# EAGLE board OpticalBoardRev2 (EAGLE 8.2.1), part 1 of 2
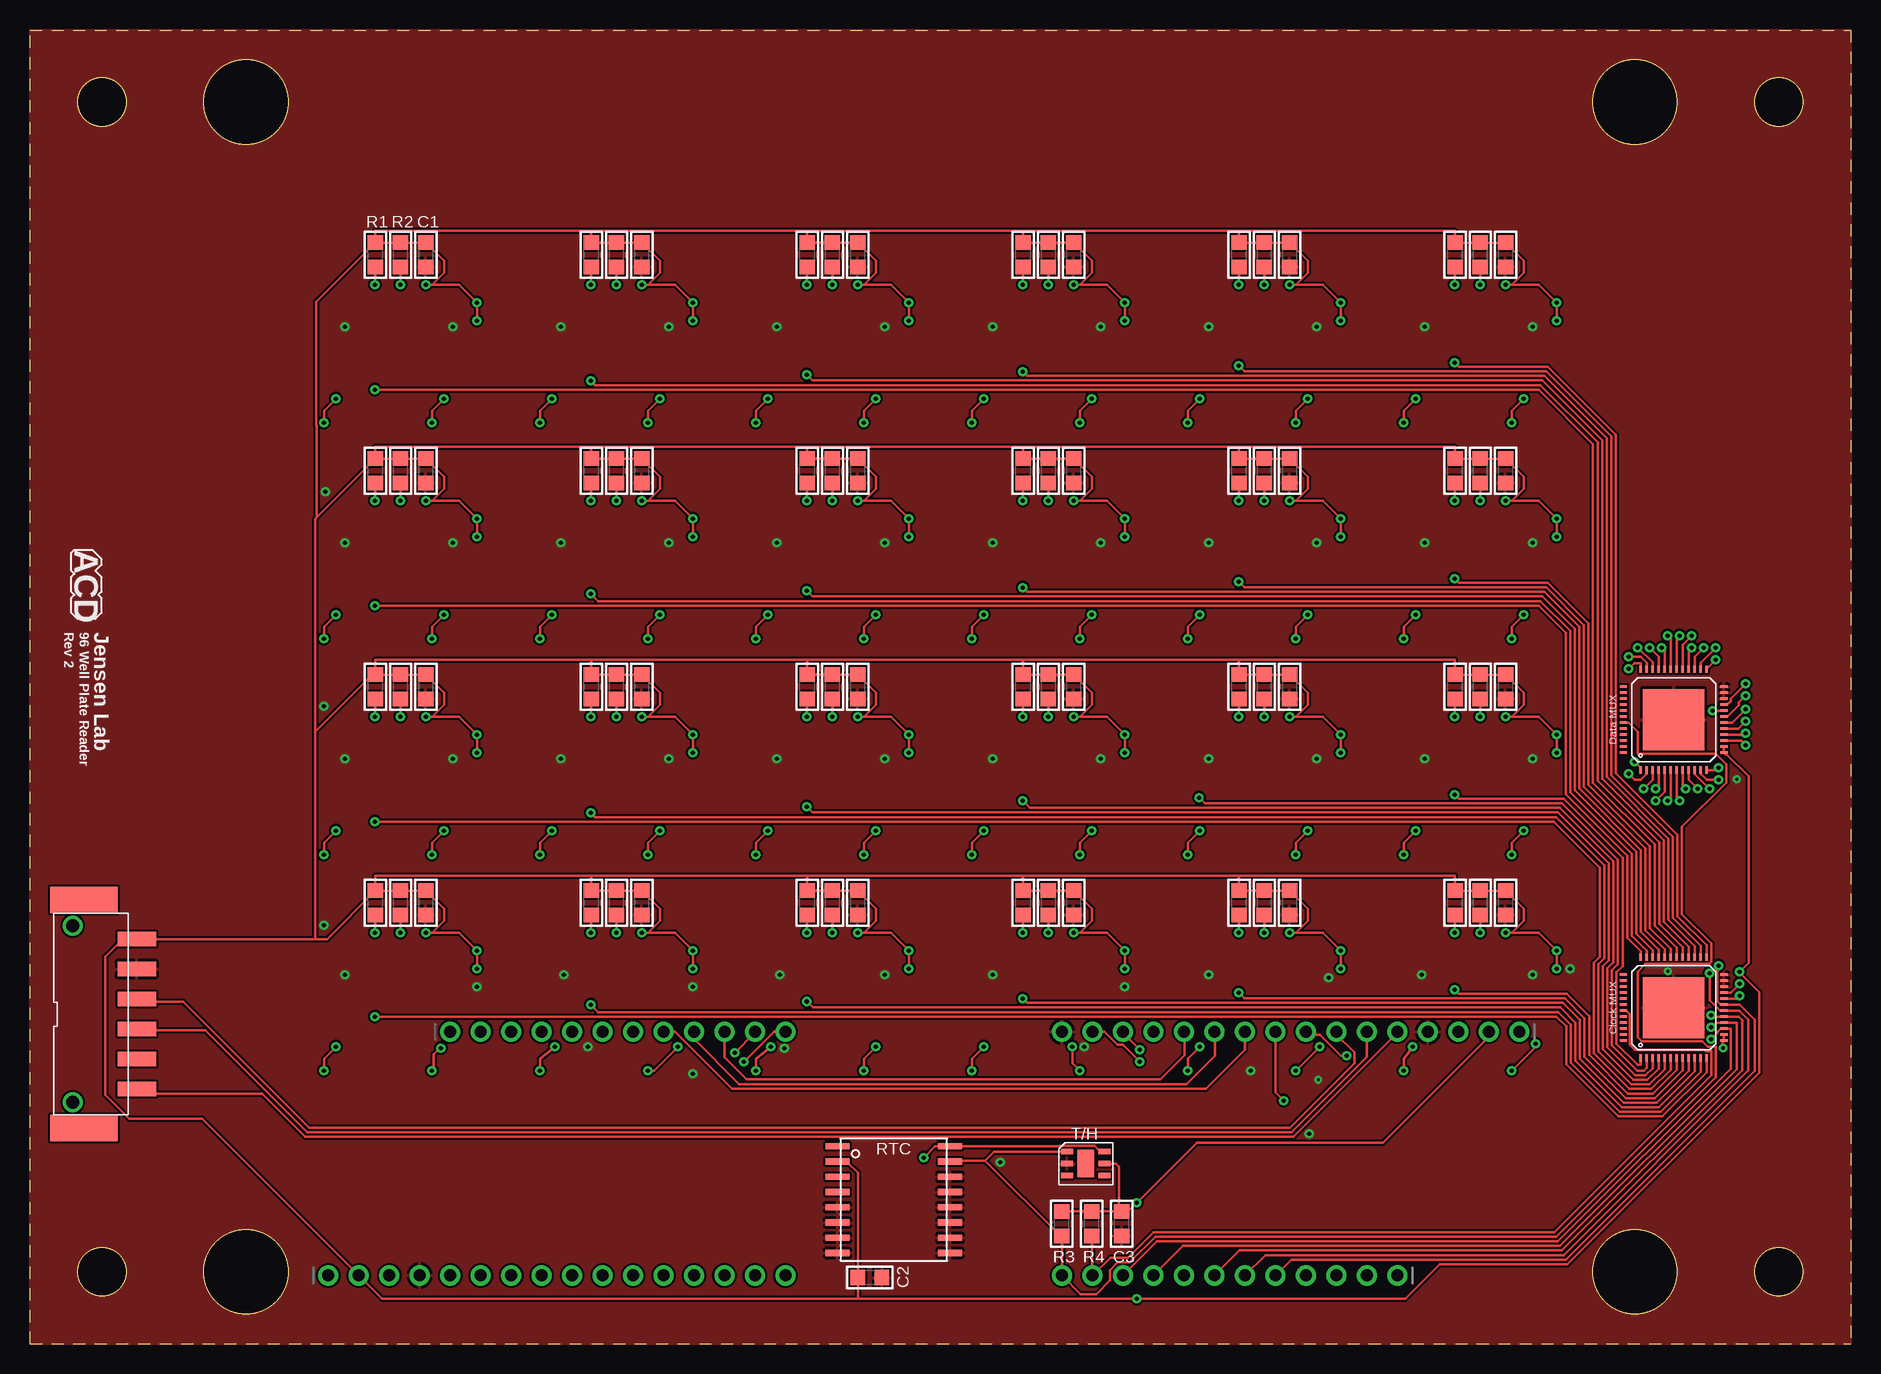
[diagram p2: board, top side]
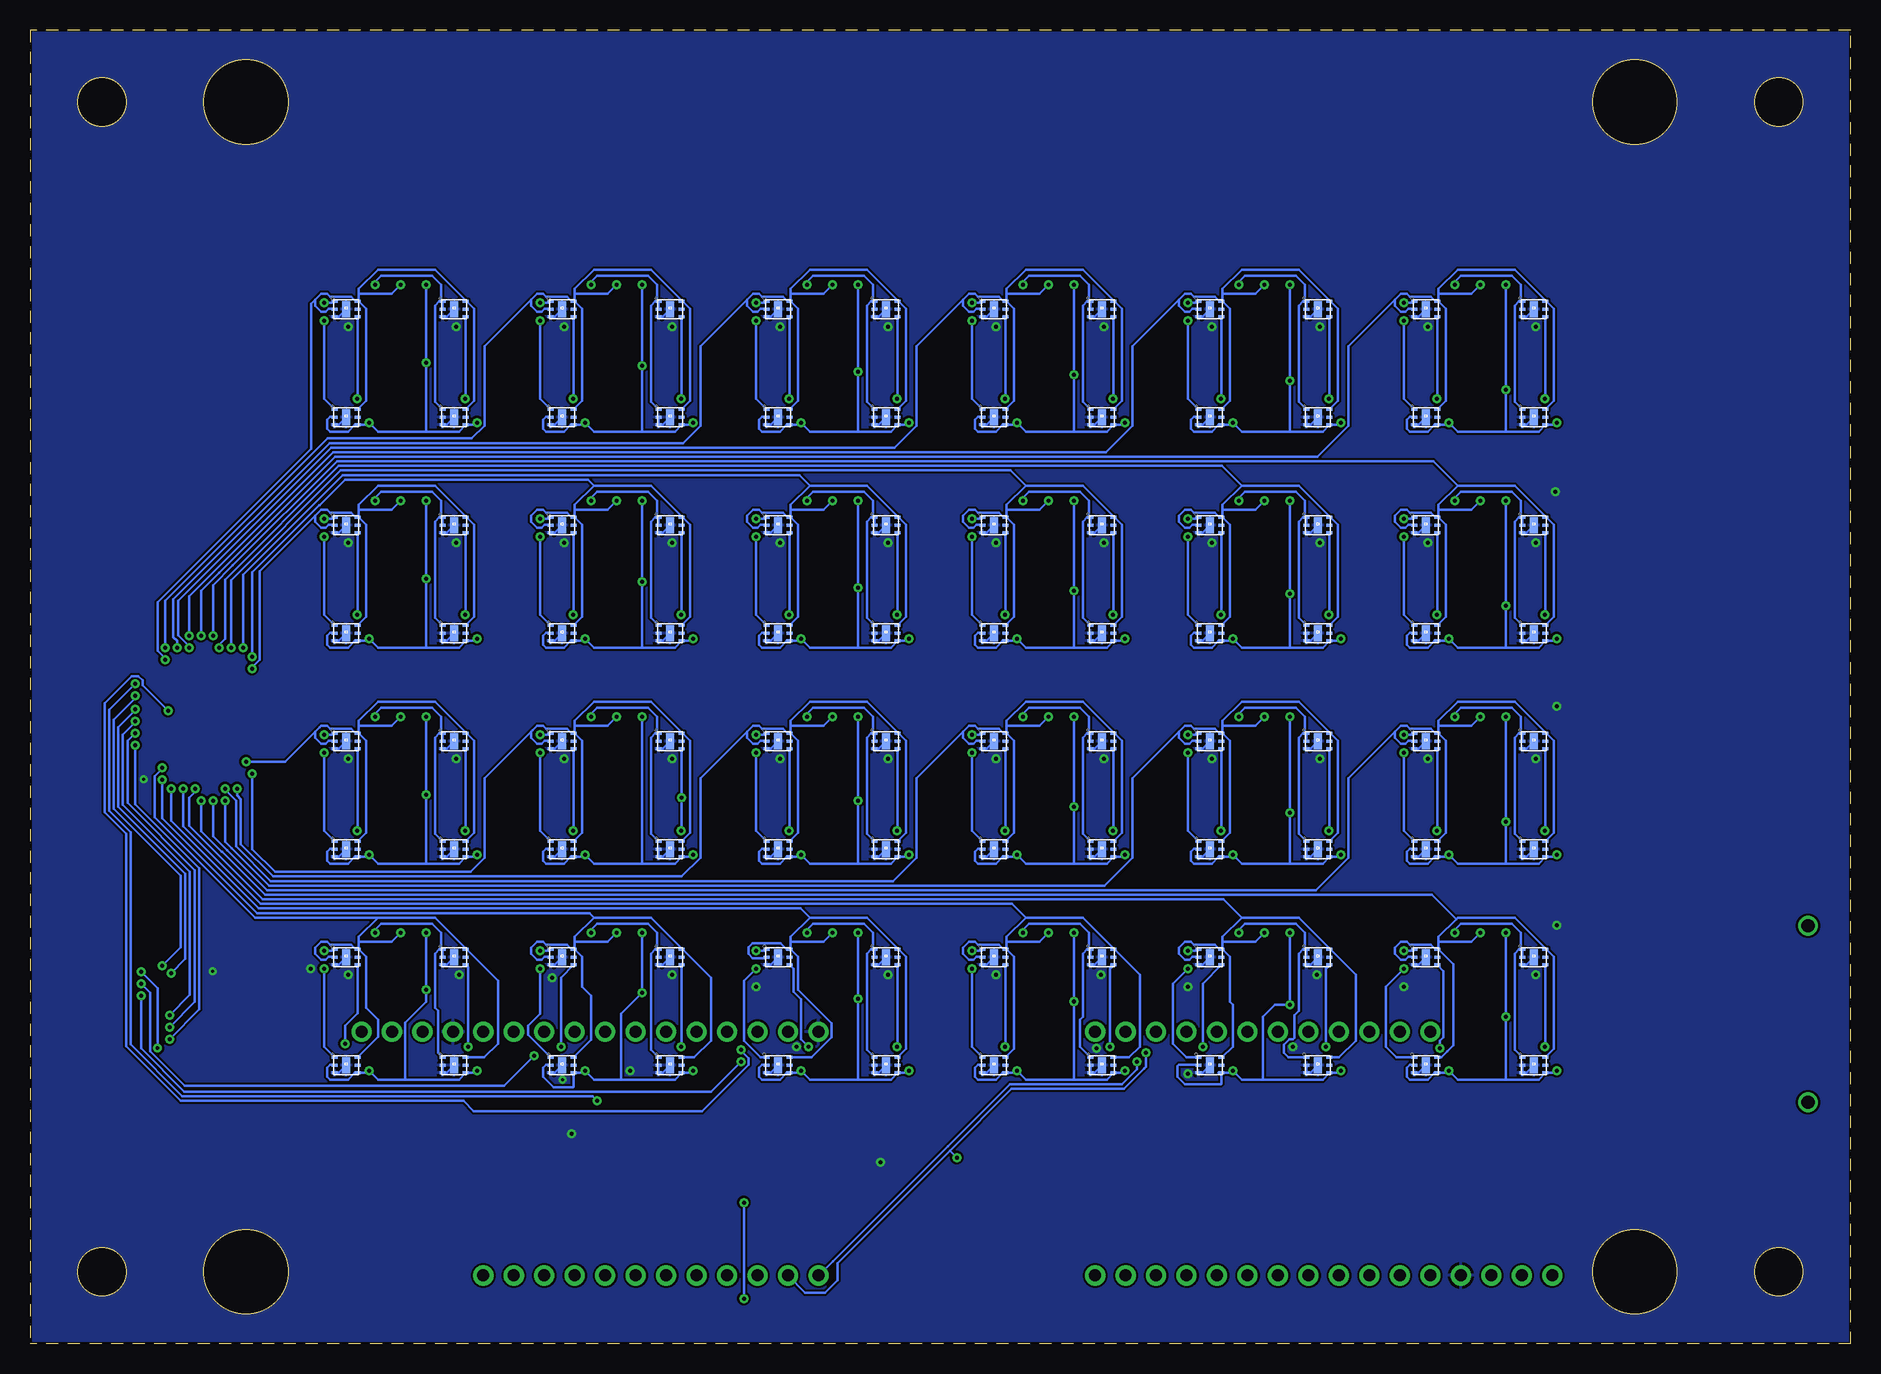
[diagram p3: board, bottom side, seen from below]

Size 151.76 x 109.47 mm. Coordinates in mm from the lower left corner, seen from the top.
Outline: 0,109.47 151.76,109.47 151.76,0 0,0 0,109.47
Outline: circle at 6,6 radius 2
Outline: circle at 145.76,6 radius 2
Outline: circle at 145.76,103.47 radius 2
Outline: circle at 6,103.47 radius 2
Outline: circle at 18,6 radius 3.5
Outline: circle at 18,103.47 radius 3.5
Outline: circle at 133.76,6 radius 3.5
Outline: circle at 133.76,103.47 radius 3.5
Copper layers (1*16): Top 0.035mm / dielectric 1.5mm / Bottom 0.035mm
Design rules "default *": minimum track width 6mil, minimum drill 0.2mm, track to track 7mil, track to pad 6mil, pad to pad 6mil, via to via 6mil, smd to smd 6mil, copper to edge 0mil, drill to drill 6mil, minimum pad ring 10mil, minimum via ring 8mil, stop-mask expansion 4mil, vias tented up to drill 0mil, thermal gap 10mil
Holes 4 mm at 6,6 145.76,6 6,103.47 145.76,103.47
Holes 7 mm at 18,103.47 133.76,103.47 18,6 133.76,6

## Footprints (pad centres in the part's own frame; a part is rotated, then mirrored left to right if it is on the bottom)
_0805 = smd 1.2 x 1.3: 1 -1.016,0; 2 1.016,0
1X12_ROUND = drill 1 pad 1.676: 1 -13.97,0; 2 -11.43,0; 3 -8.89,0; 4 -6.35,0; 5 -3.81,0; 6 -1.27,0; 7 1.27,0; 8 3.81,0; 9 6.35,0; 10 8.89,0; 11 11.43,0; 12 13.97,0
1X16_ROUND = drill 1 pad 1.676: 1 -19.05,0; 2 -16.51,0; 3 -13.97,0; 4 -11.43,0; 5 -8.89,0; 6 -6.35,0; 7 -3.81,0; 8 -1.27,0; 9 1.27,0; 10 3.81,0; 11 6.35,0; 12 8.89,0; 13 11.43,0; 14 13.97,0; 15 16.51,0; 16 19.05,0
2X2-OPT3002-2 = smd 0.5 x 0.25 bottom: 1 -0.95,0.56; 2 -0.95,-0.09; 3 -0.95,-0.74; 4 0.95,-0.74; 5 0.95,-0.09; 6 0.95,0.56; 8 -0.95,9.56; 9 -0.95,8.91; 10 -0.95,8.26; 11 0.95,8.26; 12 0.95,8.91; 13 0.95,9.56; 15 8.05,9.56; 16 8.05,8.91; 17 8.05,8.26; 18 9.95,8.26; 19 9.95,8.91; 20 9.95,9.56; 22 8.05,0.56; 23 8.05,-0.09; 24 8.05,-0.74; 25 9.95,-0.74; 26 9.95,-0.09; 27 9.95,0.56 | smd 0.65 x 1.35 bottom: 7 0,-0.09; 14 0,8.91; 21 9,8.91; 28 9,-0.09 | smd 1.3 x 1.2: 29 6.59,14.456; 30 6.59,12.424; 31 2.39,12.424; 32 2.39,14.456; 33 4.49,12.424; 34 4.49,14.456
CONNECTOR_6PIN = smd 1.2 x 3.2: 1 -6.25,4.4; 2 -3.75,4.4; 3 -1.25,4.4; 4 1.25,4.4; 5 3.75,4.4; 6 6.25,4.4 | drill 1.1: 7 -7.35,-0.95; 8 7.35,-0.95 | smd 2.2 x 5.6: LMOUNT -9.5,0; RMOUNT 9.5,0
32MUX = smd 0.6 x 0.22: 1 -4.2,2.75; 2 -4.2,2.25; 3 -4.2,1.75; 4 -4.2,1.25; 5 -4.2,0.75; 6 -4.2,0.25; 7 -4.2,-0.25; 8 -4.2,-0.75; 9 -4.2,-1.25; 10 -4.2,-1.75; 11 -4.2,-2.25; 12 -4.2,-2.75; 25 4.2,-2.75; 26 4.2,-2.25; 27 4.2,-1.75; 28 4.2,-1.25; 29 4.2,-0.75; 30 4.2,-0.25; 31 4.2,0.25; 32 4.2,0.75; 33 4.2,1.25; 34 4.2,1.75; 35 4.2,2.25; 36 4.2,2.75 | smd 0.22 x 0.6: 13 -2.75,-4.2; 14 -2.25,-4.2; 15 -1.75,-4.2; 16 -1.25,-4.2; 17 -0.75,-4.2; 18 -0.25,-4.2; 19 0.25,-4.2; 20 0.75,-4.2; 21 1.25,-4.2; 22 1.75,-4.2; 23 2.25,-4.2; 24 2.75,-4.2; 37 2.75,4.2; 38 2.25,4.2; 39 1.75,4.2; 40 1.25,4.2; 41 0.75,4.2; 42 0.25,4.2; 43 -0.25,4.2; 44 -0.75,4.2; 45 -1.25,4.2; 46 -1.75,4.2; 47 -2.25,4.2; 48 -2.75,4.2 | smd 5.1 x 5.1: 49 0,0
32MUX_BOT = smd 0.6 x 0.22 bottom: 1 4.2,2.75; 2 4.2,2.25; 3 4.2,1.75; 4 4.2,1.25; 5 4.2,0.75; 6 4.2,0.25; 7 4.2,-0.25; 8 4.2,-0.75; 9 4.2,-1.25; 10 4.2,-1.75; 11 4.2,-2.25; 12 4.2,-2.75; 25 -4.2,-2.75; 26 -4.2,-2.25; 27 -4.2,-1.75; 28 -4.2,-1.25; 29 -4.2,-0.75; 30 -4.2,-0.25; 31 -4.2,0.25; 32 -4.2,0.75; 33 -4.2,1.25; 34 -4.2,1.75; 35 -4.2,2.25; 36 -4.2,2.75 | smd 0.22 x 0.6 bottom: 13 2.75,-4.2; 14 2.25,-4.2; 15 1.75,-4.2; 16 1.25,-4.2; 17 0.75,-4.2; 18 0.25,-4.2; 19 -0.25,-4.2; 20 -0.75,-4.2; 21 -1.25,-4.2; 22 -1.75,-4.2; 23 -2.25,-4.2; 24 -2.75,-4.2; 37 -2.75,4.2; 38 -2.25,4.2; 39 -1.75,4.2; 40 -1.25,4.2; 41 -0.75,4.2; 42 -0.25,4.2; 43 0.25,4.2; 44 0.75,4.2; 45 1.25,4.2; 46 1.75,4.2; 47 2.25,4.2; 48 2.75,4.2 | smd 5.1 x 5.1 bottom: 49 0,0
RTC = smd 1.98 x 0.53: 1 -4.685,4.445; 2 -4.685,3.175; 3 -4.685,1.905; 4 -4.685,0.635; 5 -4.685,-0.635; 6 -4.685,-1.905; 7 -4.685,-3.175; 8 -4.685,-4.445; 9 4.685,-4.445; 10 4.685,-3.175; 11 4.685,-1.905; 12 4.685,-0.635; 13 4.685,0.635; 14 4.685,1.905; 15 4.685,3.175; 16 4.685,4.445
TH_NEW = smd 1 x 0.45: DNC1 -1.55,-1; DNC2 1.55,-1; GND -1.55,0; SCL 1.55,1; SDA -1.55,1; VDD 1.55,0 | smd 1.4 x 2.3: PADDLE 0,0

## Placement (x,y rotation side)
C1  1uF  [_0805]  70,5.5 180 top
C2  0.1uF  [_0805]  91,10 90 top
JP1  [1X12_ROUND]  100,5.68 180 top
JP2  [1X16_ROUND]  105.08,26 180 top
JP3  [1X16_ROUND]  43.92,5.68 0 top
JP4  [1X12_ROUND]  49,26 0 top
R1  10K  [_0805]  88.5,10 90 top
R2  10K  [_0805]  86,10 90 top
U$1  2X2-OPT30022  [2X2-OPT3002-2]  26.4,23.3 0 top
U$2  2X2-OPT30022  [2X2-OPT3002-2]  26.4,41.3 0 top
U$3  2X2-OPT30022  [2X2-OPT3002-2]  26.4,59.3 0 top
U$4  2X2-OPT30022  [2X2-OPT3002-2]  26.4,77.3 0 top
U$5  2X2-OPT30022  [2X2-OPT3002-2]  44.4,23.3 0 top
U$6  2X2-OPT30022  [2X2-OPT3002-2]  44.4,41.3 0 top
U$7  2X2-OPT30022  [2X2-OPT3002-2]  44.4,59.3 0 top
U$8  2X2-OPT30022  [2X2-OPT3002-2]  44.4,77.3 0 top
U$9  2X2-OPT30022  [2X2-OPT3002-2]  62.4,23.3 0 top
U$10  2X2-OPT30022  [2X2-OPT3002-2]  62.4,41.3 0 top
U$11  2X2-OPT30022  [2X2-OPT3002-2]  62.4,59.3 0 top
U$12  2X2-OPT30022  [2X2-OPT3002-2]  62.4,77.3 0 top
U$13  2X2-OPT30022  [2X2-OPT3002-2]  80.4,23.3 0 top
U$14  2X2-OPT30022  [2X2-OPT3002-2]  80.4,41.3 0 top
U$15  2X2-OPT30022  [2X2-OPT3002-2]  80.4,59.3 0 top
U$16  2X2-OPT30022  [2X2-OPT3002-2]  80.4,77.3 0 top
U$17  2X2-OPT30022  [2X2-OPT3002-2]  98.4,23.3 0 top
U$18  2X2-OPT30022  [2X2-OPT3002-2]  98.4,41.3 0 top
U$19  2X2-OPT30022  [2X2-OPT3002-2]  98.4,59.3 0 top
U$20  2X2-OPT30022  [2X2-OPT3002-2]  98.4,77.3 0 top
U$21  2X2-OPT30022  [2X2-OPT3002-2]  116.4,23.3 0 top
U$22  2X2-OPT30022  [2X2-OPT3002-2]  116.4,41.3 0 top
U$23  2X2-OPT30022  [2X2-OPT3002-2]  116.4,59.3 0 top
U$24  2X2-OPT30022  [2X2-OPT3002-2]  116.4,77.3 0 top
U$25  CONNECTOR_6PIN  [CONNECTOR_6PIN]  4.5,27.47 270 top
U$26  32MUXTOP  [32MUX]  137,52 90 top
U$27  32MUXBOT  [32MUX_BOT]  137,28 270 bottom
U$28  RTC  [RTC]  72,12 0 top
U$29  TH_NEW  [TH_NEW]  88,15 0 top

## Tracks (layer width: path | path; a pad name or v marks a point on that pad's centre or on a via)
A
  Top 0.203: JP4.8 53.75,26 58.5,21.25 98,21.25 101.25,24.5 101.25,25.98 JP2.10
A0  (via drill 0.35)
  Top 0.203: JP1.10 93.95,8.52 127.37,8.52 141.75,22.91 141.75,25.96 141.75,25.97 141.75,26.25 U$27.15 140.93,26.25 140.65,25.96 140.65,25.9 v140.12,25.38 | U$26.15 142.62,50.25 v143,49.88
  Bottom 0.203: v140.12,25.38 137.64,27.86 137.64,39.61 143,44.96 v143,49.88
A1  (via drill 0.35)
  Top 0.203: JP1.9 96.11,8.14 127.53,8.14 142.25,22.87 142.25,26.75 U$27.16 140.5,26.75 v140.12,26.38 | U$26.16 142.88,50.75 v143,50.88
  Bottom 0.203: v140.12,26.38 138.03,28.48 138.03,39.45 143.63,45.05 143.63,50.14 143.62,50.14 143.62,50.25 v143,50.88
A2  (via drill 0.35)
  Top 0.203: v140.12,27.38 140.25,27.25 U$27.17 142.42,27.25 142.71,26.96 142.71,22.79 127.68,7.76 100.81,7.76 JP1.7 | U$26.17 142.38,51.25 v143,51.88
  Bottom 0.203: v140.12,27.38 138.43,29.07 138.43,39.32 144.01,44.9 144.01,50.76 143,51.77 v143,51.88
A3  (via drill 0.35)
  Top 0.203: v140,30.88 140,28.62 140.88,27.75 U$27.18 142.46,27.75 143.23,26.98 143.23,22.77 127.84,7.38 102.97,7.38 JP1.6 | U$26.18 141.88,51.75 v143,52.88
  Bottom 0.203: 138.81,34.06 138.83,34.08 | 138.81,34.06 138.81,33.75 138.81,32.06 v140,30.88 | v143,52.88 143,52.77 144.39,51.38 144.39,44.74 138.81,39.16 138.81,34.06
A4  (via drill 0.35)
  Top 0.203: v140.75,31.5 140.65,31.4 140.65,28.54 140.93,28.25 U$27.19 142.5,28.25 143.75,27 143.75,22.75 128,7 105.13,7 JP1.5 | U$26.19 141.47,52.25 142.44,53.22 142.44,53.44 v143,54
  Bottom 0.203: v140.75,31.5 139.21,33.04 139.21,34.23 139.19,34.25 139.19,39 144.78,44.58 144.78,51.99 143,53.77 v143,54
B
  Top 0.203: JP4.9 55.35,25.4 59.12,21.63 70.25,21.63 96.38,21.63 98.75,24 98.75,25.98 JP2.11
C
  Top 0.203: JP4.10 57.89,23.86 59.74,22.01 68.75,22.01 94.22,22.01 96.23,24.02 96.23,25.96 JP2.12
CS1  (via drill 0.35)
  Top 0.203: JP2.14 91.11,25.89 v92.5,24.5 | U$26.20 v140.25,52.75
  Bottom 0.203: v140.25,52.75 142.37,54.87 142.37,55.26 142.74,55.63 143.26,55.63 145.54,53.36 145.54,44.58 | 145.54,44.58 | 145.54,44.58 145.54,44.27 143.75,42.48 143.75,24.77 139.21,20.24 115.63,20.24 114.76,19.37 95.74,19.37 91.87,23.24 91.87,23.76 92.5,24.39 v92.5,24.5
CS2  (via drill 0.35)
  Top 0.203: U$27.20 142.25,28.75 v142.5,29 | v92.5,23.5 91.09,24.91 90.66,24.91 89.56,26 JP2.15
  Bottom 0.203: v142.5,29 142.5,24.6 138.9,21 108.75,21 95,21 v92.5,23.5
GND  (via drill 0.25, 0.35)
  Top 0.203: U$1.30 32.99,35.24 | U$2.30 32.99,53.24 | U$3.30 32.99,71.24 | U$4.30 32.99,89.24 | U$8.30 50.99,89.24 | U$7.30 50.99,71.24 | U$5.30 50.99,35.24 | U$9.30 68.99,35.24 | U$10.30 68.99,53.24 | U$11.30 68.99,71.24 | U$12.30 68.99,89.24 | U$16.30 86.99,89.24 | U$15.30 86.99,71.24 | U$14.30 86.99,53.24 | U$13.30 86.99,35.24 | U$17.30 104.99,35.24 | U$18.30 104.99,53.24 | U$19.30 104.99,71.24 | U$20.30 104.99,89.24 | U$24.30 122.99,89.24 | U$23.30 122.99,71.24 | U$22.30 122.99,53.24 | 122.99,35.24 U$21.30 | U$6.30 50.99,53.24
  Bottom 0.203: U$1.21 36.05,31.56 U$1.18 | U$1.25 36.05,22.56 U$1.28 | U$1.7 27.05,22.56 U$1.4 U$1.5 | U$1.14 27.05,31.56 U$1.11 27.38,31.53 | U$2.21 36.05,49.56 U$2.18 | U$2.25 36.05,40.56 U$2.28 | U$2.7 27.05,40.56 U$2.4 U$2.5 | U$2.14 27.05,49.56 U$2.11 27.38,49.53 | U$3.21 36.05,67.56 U$3.18 | U$3.25 36.05,58.56 U$3.28 | U$3.7 27.05,58.56 U$3.4 U$3.5 | U$3.14 27.05,67.56 U$3.11 27.38,67.53 | U$4.21 36.05,85.56 U$4.18 | U$4.25 36.05,76.56 U$4.28 | U$4.7 27.05,76.56 U$4.4 U$4.5 | U$4.14 27.05,85.56 U$4.11 27.38,85.53 | U$8.21 54.05,85.56 U$8.18 | U$8.25 54.05,76.56 U$8.28 | U$8.7 45.05,76.56 U$8.4 U$8.5 | U$8.14 45.05,85.56 U$8.11 45.38,85.53 | U$7.21 54.05,67.56 U$7.18 | U$7.25 54.05,58.56 U$7.28 | U$7.7 45.05,58.56 U$7.4 U$7.5 | U$7.14 45.05,67.56 U$7.11 45.38,67.53 | U$5.21 54.05,31.56 U$5.18 | U$5.25 54.05,22.56 U$5.28 | U$5.7 45.05,22.56 U$5.4 U$5.5 | U$5.14 45.05,31.56 U$5.11 45.38,31.53 | U$9.21 72.05,31.56 U$9.18 | U$9.25 72.05,22.56 U$9.28 | U$9.7 63.05,22.56 U$9.4 U$9.5 | U$9.14 63.05,31.56 U$9.11 63.38,31.53 | U$10.21 72.05,49.56 U$10.18 | U$10.25 72.05,40.56 U$10.28 | U$10.7 63.05,40.56 U$10.4 U$10.5 | U$10.14 63.05,49.56 U$10.11 63.38,49.53 | U$11.21 72.05,67.56 U$11.18 | U$11.25 72.05,58.56 U$11.28 | U$11.7 63.05,58.56 U$11.4 U$11.5 | U$11.14 63.05,67.56 U$11.11 63.38,67.53 | U$12.21 72.05,85.56 U$12.18 | U$12.25 72.05,76.56 U$12.28 | U$12.7 63.05,76.56 U$12.4 U$12.5 | U$12.14 63.05,85.56 U$12.11 63.38,85.53 | U$16.21 90.05,85.56 U$16.18 | U$16.25 90.05,76.56 U$16.28 | U$16.7 81.05,76.56 U$16.4 U$16.5 | U$16.14 81.05,85.56 U$16.11 81.38,85.53 | U$15.21 90.05,67.56 U$15.18 | U$15.25 90.05,58.56 U$15.28 | U$15.7 81.05,58.56 U$15.4 U$15.5
  Bottom 0.203: U$15.14 81.05,67.56 U$15.11 81.38,67.53 | U$14.21 90.05,49.56 U$14.18 | U$14.25 90.05,40.56 U$14.28 | U$14.7 81.05,40.56 U$14.4 U$14.5 | U$14.14 81.05,49.56 U$14.11 81.38,49.53 | U$13.21 90.05,31.56 U$13.18 | U$13.25 90.05,22.56 U$13.28 | U$13.7 81.05,22.56 U$13.4 U$13.5 | U$13.14 81.05,31.56 U$13.11 81.38,31.53 | U$17.21 108.05,31.56 U$17.18 | U$17.25 108.05,22.56 U$17.28 | U$17.7 99.05,22.56 U$17.4 U$17.5 | U$17.14 99.05,31.56 U$17.11 99.38,31.53 | U$18.21 108.05,49.56 U$18.18 | U$18.25 108.05,40.56 U$18.28 | U$18.7 99.05,40.56 U$18.4 U$18.5 | U$18.14 99.05,49.56 U$18.11 99.38,49.53 | U$19.21 108.05,67.56 U$19.18 | U$19.25 108.05,58.56 U$19.28 | U$19.7 99.05,58.56 U$19.4 U$19.5 | U$19.14 99.05,67.56 U$19.11 99.38,67.53 | U$20.21 108.05,85.56 U$20.18 | U$20.25 108.05,76.56 U$20.28 | U$20.7 99.05,76.56 U$20.4 U$20.5 | U$20.14 99.05,85.56 U$20.11 99.38,85.53 | U$24.21 126.05,85.56 U$24.18 | U$24.25 126.05,76.56 U$24.28 | U$24.7 117.05,76.56 U$24.4 U$24.5 | U$24.14 117.05,85.56 U$24.11 117.38,85.53 | U$23.21 126.05,67.56 U$23.18 | U$23.25 126.05,58.56 U$23.28 | U$23.7 117.05,58.56 U$23.4 U$23.5 | U$23.14 117.05,67.56 U$23.11 117.38,67.53 | U$22.21 126.05,49.56 U$22.18 | U$22.25 126.05,40.56 U$22.28 | U$22.7 117.05,40.56 U$22.4 U$22.5 | U$22.14 117.05,49.56 U$22.11 117.38,49.53 | U$21.21 126.05,31.56 U$21.18 | U$21.25 126.05,22.56 U$21.28 | U$21.7 117.05,22.56 U$21.4 U$21.5 | U$21.14 117.05,31.56 U$21.11 117.38,31.53 | U$6.21 54.05,49.56 U$6.18 | U$6.25 54.05,40.56 U$6.28 | U$6.7 45.05,40.56 U$6.4 U$6.5 | U$6.14 45.05,49.56 U$6.11 45.38,49.53
  Bottom 0.254: 35.44,23.17 U$1.28 | 35.44,41.17 U$2.28 | 35.44,59.17 U$3.28 | 35.44,77.17 U$4.28 | 53.44,77.17 U$8.28 | 53.44,59.17 U$7.28 | 53.44,23.17 U$5.28 | 71.44,23.17 U$9.28 | 71.44,41.17 U$10.28 | 71.44,59.17 U$11.28 | 71.44,77.17 U$12.28 | 89.44,77.17 U$16.28 | 89.44,59.17 U$15.28 | 89.44,41.17 U$14.28 | 89.44,23.17 U$13.28 | 107.44,23.17 U$17.28 | 107.44,41.17 U$18.28 | 107.44,59.17 U$19.28 | 107.44,77.17 U$20.28 | 125.44,77.17 U$24.28 | 125.44,59.17 U$23.28 | 125.44,41.17 U$22.28 | 125.44,23.17 U$21.28 | 53.44,41.17 U$6.28
  other vias: 125.25,66.75 116.25,66.75 125.25,84.75 116.25,84.75 125.25,48.75 116.25,48.75 116,30.75 125.25,30.75 108.25,30.5 98.25,30.75 98.25,48.75 107.25,48.75 107.25,66.75 98.25,66.75 98.25,84.75 107.25,84.75 89.25,84.75 80.25,84.75 80.25,66.75 89.25,66.75 89.25,48.75 80.25,48.75 80.25,30.75 91.25,29.75 71.25,30.75 62.5,30.75 62.25,48.75 71.25,48.75 71.25,66.75 62.25,66.75 62.25,84.75 71.25,84.75 53.25,84.75 44.25,84.75 44.25,66.75 53.25,66.75 53.25,48.75 44.25,48.75 44.5,30.75 55.25,29.75 37.25,29.75 26.25,30.75 26.25,48.75 35.25,48.75 35.25,66.75 26.25,66.75 26.25,84.75 35.25,84.75 136.53,31.03 128.38,31.25 106.62,17.5 46.5,24.75 55.25,22.5 62.88,24.62 107.38,22 101.75,22.75 87.88,24.75 142.28,47.03 80.88,15.12 24.5,34.88 24.5,53.12 24.62,71
  pour Top: 0,0 151.76,0 151.76,109.47 0,109.47
  pour Bottom: 0.25,109.25 0.25,0.25 151.5,0.25 151.5,109.25
LEDCLK
  Top 0.203: 8.93,26.25 U$25.4 9.01,26.11 14.61,26.11 23.09,17.62 105.16,17.62 111.43,23.89 JP2.6
LEDDAT
  Top 0.203: 109,26 JP2.7 108.89,25.75 110.38,24.26 110.38,23.38 105,18 23.25,18 12.75,28.5 9.12,28.5 U$25.3
LEDLAT
  Top 0.203: 23.25,17.24 | 23.25,17.24 22.93,17.24 19.34,20.84 9.28,20.84 U$25.6 | 23.25,17.24 105.32,17.24 113.97,25.89 JP2.5
SCL1  (via drill 0.35)
  Top 0.203: v24.5,22.75 24.5,23.75 v25.5,24.75 | U$1.31 28.75,35.68 v28.75,34.25 | v28.75,27.25 127.24,27.25 128.06,26.43 128.06,23.27 132.38,18.94 136.08,18.94 139.75,22.61 U$27.12 | v34.25,24.62 34.12,24.62 33.62,24.12 33.62,22.88 v33.5,22.75
  Bottom 0.203: U$1.26 36.39,23.25 36.75,23.25 37,23 37,22.25 36.75,22 35.25,22 34.69,22.56 U$1.24 33.69,22.56 v33.5,22.75 | U$1.3 24.69,22.56 v24.5,22.75 | v25.5,24.75 25.45,24.8 U$1.10 | U$1.3 | v33.5,22.75 33.25,22.5 | U$1.3 26,22.01 26,22 28.75,22 | v33.5,22.75 32.75,22 28.75,22 | v28.75,34.25 v28.75,27.25 28.75,22 | v34.25,24.62 34.25,25.23 33.94,25.55 33.94,31.05 U$1.17
SCL2  (via drill 0.35)
  Top 0.203: v33.5,40.75 33.5,41.75 v34.5,42.75 | v24.5,40.75 24.5,41.75 v25.5,42.75 | U$2.31 28.75,53.68 v28.75,52.25 | 123.25,43.5 v28.75,43.5 | 123.25,43.5 123.69,43.5 | U$27.6 136.75,22.84 135.13,21.23 133.33,21.23 130.34,24.21 130.34,31.75 130.84,32.26 130.84,39.66 127,43.5 123.25,43.5
  Bottom 0.203: U$2.26 36.39,41.25 36.75,41.25 37,41 37,40.25 36.75,40 35.25,40 34.69,40.56 U$2.24 33.69,40.56 v33.5,40.75 | v34.5,42.75 34.45,42.8 U$2.17 | U$2.3 24.69,40.56 v24.5,40.75 | v25.5,42.75 25.45,42.8 U$2.10 | U$2.3 | v33.5,40.75 33.25,40.5 | U$2.3 26,40.01 26,40 28.75,40 | v33.5,40.75 32.75,40 28.75,40 | v28.75,52.25 v28.75,43.5 28.75,40
SCL3  (via drill 0.35)
  Top 0.203: v33.5,58.75 33.5,59.75 v34.5,60.75 | v24.5,58.75 24.5,59.75 v25.5,60.75 | U$3.31 28.75,71.68 v28.75,70.25 | v28.75,61.5 125.75,61.5 128,59.25 128,45.79 133.13,40.66 133.13,33.83 134.25,32.71 U$27.36
  Bottom 0.203: U$3.26 36.39,59.25 36.75,59.25 37,59 37,58.25 36.75,58 35.25,58 34.69,58.56 U$3.24 33.69,58.56 v33.5,58.75 | v34.5,60.75 34.45,60.8 U$3.17 | U$3.3 24.69,58.56 v24.5,58.75 | v25.5,60.75 25.45,60.8 U$3.10 | U$3.3 | v33.5,58.75 33.25,58.5 | U$3.3 26,58.01 26,58 28.75,58 | v33.5,58.75 32.75,58 28.75,58 | v28.75,70.25 v28.75,61.5 28.75,58
SCL4  (via drill 0.35)
  Top 0.203: v33.5,76.75 33.5,77.75 v34.5,78.75 | v24.5,76.75 24.5,77.75 v25.5,78.75 | U$4.31 28.75,89.68 v28.75,88.25 | v28.75,79.5 125.75,79.5 130.29,74.96 130.29,46.75 135.42,41.62 135.42,34.83 137.25,33 U$27.30
  Bottom 0.203: U$4.26 36.39,77.25 36.75,77.25 37,77 37,76.25 36.75,76 35.25,76 34.69,76.56 U$4.24 33.69,76.56 v33.5,76.75 | v34.5,78.75 34.45,78.8 U$4.17 | U$4.3 24.69,76.56 v24.5,76.75 | v25.5,78.75 25.45,78.8 U$4.10 | U$4.3 | v33.5,76.75 33.25,76.5 | U$4.3 26,76.01 26,76 28.75,76 | v33.5,76.75 32.75,76 28.75,76 | v28.75,88.25 v28.75,79.5 28.75,76
SCL5  (via drill 0.35)
  Top 0.203: v42.5,22.75 42.5,23.75 v43.75,24.75 | U$5.31 46.75,35.68 v46.75,34.25 | v46.75,28.25 47.37,27.63 127.4,27.63 128.44,26.59 128.44,23.43 132.54,19.32 135.92,19.32 139.25,22.65 U$27.11 | v54,24.75 52,22.75 v51.5,22.75
  Bottom 0.203: U$5.26 54.39,23.25 56,23.25 56.12,23.12 56.12,22.25 55.5,21.62 52.5,21.62 52.45,21.68 U$5.24 | 52.69,22.56 U$5.24 | U$5.24 51.69,22.56 v51.5,22.75 | U$5.3 42.69,22.56 v42.5,22.75 | U$5.3 | v51.5,22.75 51.25,22.5 | U$5.3 44,22.01 44,22 49,22 | v51.5,22.75 50.75,22 49,22 | v46.75,34.25 v46.75,28.25 48,28.25 49,27.25 49,22 | U$5.17 54,30.01 v54,24.75 | U$5.10 43.75,31.26 v43.75,24.75
SCL6  (via drill 0.35)
  Top 0.203: v51.5,40.75 51.5,41.75 v52.5,42.75 | v42.5,40.75 42.5,41.75 v43.5,42.75 | U$6.31 46.75,53.68 v46.75,52.25 | v46.75,44.25 47.12,43.88 127.21,43.88 131.23,39.87 131.23,32.1 130.72,31.6 130.72,24.37 133.49,21.61 134.97,21.61 136.25,22.88 U$27.5
  Bottom 0.203: U$6.26 54.39,41.25 54.75,41.25 55,41 55,40.25 54.75,40 53.25,40 52.69,40.56 U$6.24 51.69,40.56 v51.5,40.75 | v52.5,42.75 52.45,42.8 U$6.17 | U$6.3 42.69,40.56 v42.5,40.75 | v43.5,42.75 43.45,42.8 U$6.10 | U$6.3 | v51.5,40.75 51.25,40.5 | U$6.3 44,40.01 44,40 46.75,40 | v51.5,40.75 50.75,40 46.75,40 | v46.75,52.25 v46.75,44.25 46.75,40
SCL7  (via drill 0.35)
  Top 0.203: v43.5,60.75 42.5,59.75 v42.5,58.75 | U$7.31 46.75,71.68 v46.75,70.25 | v52.5,60.75 51.5,59.75 v51.5,58.75 | v46.75,62.5 47.37,61.88 125.91,61.88 128.38,59.41 128.38,45.95 133.51,40.82 133.51,33.99 134.75,32.75 U$27.35
  Bottom 0.203: U$7.26 54.39,59.25 54.75,59.25 55,59 55,58.25 54.75,58 53.25,58 52.69,58.56 U$7.24 51.69,58.56 v51.5,58.75 | U$7.10 43.45,60.8 v43.5,60.75 | U$7.17 52.45,60.8 v52.5,60.75 | v51.5,58.75 51.25,58.5 | v42.5,58.75 42.69,58.56 U$7.3 | U$7.3 | v46.75,70.25 v46.75,62.5 46.75,58 | v51.5,58.75 50.75,58 46.75,58 | U$7.3 44,58.01 44,58 46.75,58
SCL8  (via drill 0.35)
  Top 0.203: v51.5,76.75 51.5,77.75 v52.5,78.75 | v42.5,76.75 42.5,77.75 v43.5,78.75 | U$8.31 46.75,89.68 v46.75,88.25 | v46.75,80.25 47.12,79.88 125.91,79.88 130.67,75.12 130.67,46.91 135.8,41.78 135.8,35 137.75,33.05 U$27.29
  Bottom 0.203: U$8.26 54.39,77.25 54.75,77.25 55,77 55,76.25 54.75,76 53.25,76 52.69,76.56 U$8.24 51.69,76.56 v51.5,76.75 | v52.5,78.75 52.45,78.8 U$8.17 | U$8.3 42.69,76.56 v42.5,76.75 | v43.5,78.75 43.45,78.8 U$8.10 | U$8.3 | v51.5,76.75 51.25,76.5 | U$8.3 44,76.01 44,76 46.75,76 | v51.5,76.75 50.75,76 46.75,76 | v46.75,88.25 v46.75,80.25 46.75,76
SCL9  (via drill 0.35)
  Top 0.203: v69.5,22.75 69.5,23.75 v70.5,24.75 | v60.5,22.75 60.5,23.75 v61.75,24.75 | U$9.31 64.75,35.68 v64.75,34.25 | v64.75,28.51 65.25,28.01 127.56,28.01 128.82,26.75 128.82,23.58 132.7,19.7 135.76,19.7 138.75,22.69 U$27.10
  Bottom 0.203: U$9.26 72.39,23.25 72.75,23.25 73,23 73,22.25 72.75,22 71.25,22 70.69,22.56 U$9.24 69.69,22.56 v69.5,22.75 | v70.5,24.75 70.45,24.8 U$9.17 | U$9.3 60.69,22.56 v60.5,22.75 | U$9.3 | v69.5,22.75 69.25,22.5 | U$9.3 62,22.01 62,22 64.75,22 | v69.5,22.75 68.75,22 64.75,22 | v64.75,34.25 v64.75,28.51 64.75,22 | v61.75,24.75 61.75,31.26 U$9.10
SCL10  (via drill 0.35)
  Top 0.203: v69.5,40.75 69.5,41.75 v70.5,42.75 | v60.5,40.75 60.5,41.75 v61.5,42.75 | U$10.31 64.75,53.68 v64.75,52.25 | v64.75,44.75 65.24,44.26 127.37,44.26 131.61,40.03 131.61,31.94 131.1,31.44 131.1,24.53 133.65,21.99 134.82,21.99 135.75,22.92 U$27.4
  Bottom 0.203: U$10.26 72.39,41.25 72.75,41.25 73,41 73,40.25 72.75,40 71.25,40 70.69,40.56 U$10.24 69.69,40.56 v69.5,40.75 | v70.5,42.75 70.45,42.8 U$10.17 | U$10.3 60.69,40.56 v60.5,40.75 | v61.5,42.75 61.45,42.8 U$10.10 | U$10.3 | v69.5,40.75 69.25,40.5 | U$10.3 62,40.01 62,40 64.75,40 | v69.5,40.75 68.75,40 64.75,40 | v64.75,52.25 v64.75,44.75 64.75,40
SCL11  (via drill 0.35)
  Top 0.203: v69.5,58.75 69.5,59.75 v70.5,60.75 | v60.5,58.75 60.5,59.75 v61.5,60.75 | U$11.31 64.75,71.68 v64.75,70.25 | v64.75,62.75 65.24,62.26 126.07,62.26 128.76,59.57 128.76,46.1 133.89,40.97 133.89,34.15 135.25,32.79 U$27.34
  Bottom 0.203: U$11.26 72.39,59.25 72.75,59.25 73,59 73,58.25 72.75,58 71.25,58 70.69,58.56 U$11.24 69.69,58.56 v69.5,58.75 | v70.5,60.75 70.45,60.8 U$11.17 | U$11.3 60.69,58.56 v60.5,58.75 | v61.5,60.75 61.45,60.8 U$11.10 | U$11.3 | v69.5,58.75 69.25,58.5 | U$11.3 62,58.01 62,58 64.75,58 | v69.5,58.75 68.75,58 64.75,58 | v64.75,70.25 v64.75,62.75 64.75,58
SCL12  (via drill 0.35)
  Top 0.203: v69.5,76.75 69.5,77.75 v70.5,78.75 | v60.5,76.75 60.5,77.75 v61.5,78.75 | U$12.31 64.75,89.68 v64.75,88.25 | v64.75,80.75 65.24,80.26 126.07,80.26 131.05,75.28 131.05,47.07 136.18,41.94 136.18,35.16 138.25,33.09 U$27.28
  Bottom 0.203: U$12.26 72.39,77.25 72.75,77.25 73,77 73,76.25 72.75,76 71.25,76 70.69,76.56 U$12.24 69.69,76.56 v69.5,76.75 | v70.5,78.75 70.45,78.8 U$12.17 | U$12.3 60.69,76.56 v60.5,76.75 | v61.5,78.75 61.45,78.8 U$12.10 | U$12.3 | v69.5,76.75 69.25,76.5 | U$12.3 62,76.01 62,76 64.75,76 | v69.5,76.75 68.75,76 64.75,76 | v64.75,88.25 v64.75,80.75 64.75,76
SCL13  (via drill 0.35)
  Top 0.203: v78.5,22.75 78.5,23.75 v79.5,24.75 | U$13.31 82.75,35.68 v82.75,34.25 | v82.75,28.75 83.11,28.39 127.78,28.39 129.2,26.97 129.2,23.74 132.86,20.08 135.6,20.08 138.25,22.73 U$27.9 | v86.88,24.75 86.88,23.38 v87.5,22.75
  Bottom 0.203: U$13.26 90.39,23.25 90.75,23.25 91,23 91,22.25 90.75,22 89.25,22 88.69,22.56 U$13.24 87.69,22.56 v87.5,22.75 | U$13.3 78.69,22.56 v78.5,22.75 | v79.5,24.75 79.45,24.8 U$13.10 | U$13.3 | v87.5,22.75 87.25,22.5 | U$13.3 80,22.01 80,22 82.75,22 | v87.5,22.75 86.75,22 82.75,22 | v82.75,34.25 v82.75,28.75 82.75,22 | U$13.17 88.13,31.24 88.13,29.34 87.48,28.69 87.48,25.55 87.5,25.52 87.5,25.38 v86.88,24.75
SCL14  (via drill 0.35)
  Top 0.203: v87.5,40.75 87.5,41.75 v88.5,42.75 | v78.5,40.75 78.5,41.75 v79.5,42.75 | U$14.31 82.75,53.68 v82.75,52.25 | v82.75,45.25 83.36,44.64 127.53,44.64 131.99,40.18 131.99,31.79 131.48,31.28 131.48,24.69 133.8,22.37 134.66,22.37 135.25,22.96 U$27.3
  Bottom 0.203: U$14.26 90.39,41.25 90.75,41.25 91,41 91,40.25 90.75,40 89.25,40 88.69,40.56 U$14.24 87.69,40.56 v87.5,40.75 | v88.5,42.75 88.45,42.8 U$14.17 | U$14.3 78.69,40.56 v78.5,40.75 | v79.5,42.75 79.45,42.8 U$14.10 | U$14.3 | v87.5,40.75 87.25,40.5 | U$14.3 80,40.01 80,40 82.75,40 | v87.5,40.75 86.75,40 82.75,40 | v82.75,52.25 v82.75,45.25 82.75,40
SCL15  (via drill 0.35)
  Top 0.203: v87.5,58.75 87.5,59.75 v88.5,60.75 | v78.5,58.75 78.5,59.75 v79.5,60.75 | U$15.31 82.75,71.68 v82.75,70.25 | v82.75,63 83.11,62.64 126.22,62.64 129.14,59.72 129.14,46.26 134.27,41.13 134.27,34.3 135.75,32.83 U$27.33
  Bottom 0.203: U$15.26 90.39,59.25 90.75,59.25 91,59 91,58.25 90.75,58 89.25,58 88.69,58.56 U$15.24 87.69,58.56 v87.5,58.75 | v88.5,60.75 88.45,60.8 U$15.17 | U$15.3 78.69,58.56 v78.5,58.75 | v79.5,60.75 79.45,60.8 U$15.10 | U$15.3 | v87.5,58.75 87.25,58.5 | U$15.3 80,58.01 80,58 82.75,58 | v87.5,58.75 86.75,58 82.75,58 | v82.75,70.25 v82.75,63 82.75,58
SCL16  (via drill 0.35)
  Top 0.203: v87.5,76.75 87.5,77.75 v88.5,78.75 | v78.5,76.75 78.5,77.75 v79.5,78.75 | U$16.31 82.75,89.68 v82.75,88.25 | v82.75,81 83.11,80.64 126.22,80.64 131.43,75.44 131.43,47.22 136.56,42.09 136.56,35.32 138.75,33.13 U$27.27
  Bottom 0.203: U$16.26 90.39,77.25 90.75,77.25 91,77 91,76.25 90.75,76 89.25,76 88.69,76.56 U$16.24 87.69,76.56 v87.5,76.75 | v88.5,78.75 88.45,78.8 U$16.17 | U$16.3 78.69,76.56 v78.5,76.75 | v79.5,78.75 79.45,78.8 U$16.10 | U$16.3 | v87.5,76.75 87.25,76.5 | U$16.3 80,76.01 80,76 82.75,76 | v87.5,76.75 86.75,76 82.75,76 | v82.75,88.25 v82.75,81 82.75,76
SCL17  (via drill 0.35)
  Top 0.203: v105.5,22.75 v107.5,24.75 | v96.5,22.75 96.5,23.75 v97.5,24.75 | U$17.31 100.75,35.68 v100.75,34.25 | v100.75,29.25 101.23,28.77 127.94,28.77 129.58,27.13 129.58,23.9 133.01,20.46 135.45,20.46 137.75,22.77 U$27.8
  Bottom 0.203: U$17.26 108.39,23.25 108.75,23.25 109,23 109,22.25 108.13,21.38 106.49,21.38 106.45,21.43 U$17.24 105.69,22.56 v105.5,22.75 | U$17.3 96.69,22.56 v96.5,22.75 | v97.5,24.75 97.45,24.8 U$17.10 | U$17.3 | v105.5,22.75 105.25,22.5 | U$17.3 98,22.01 98,22 102.5,22 | v105.5,22.75 104.75,22 102.5,22 | v100.75,34.25 v100.75,29.25 102.5,27.5 102.5,22 | U$17.17 107.5,30.51 v107.5,24.75
SCL18  (via drill 0.35)
  Top 0.203: v105.5,40.75 105.5,41.75 v106.5,42.75 | v96.5,40.75 96.5,41.75 v97.5,42.75 | U$18.31 100.75,53.68 v100.75,52.25 | v97.45,45.5 97.93,45.02 123.25,45.02 | 123.25,45.02 123.56,45.02 | U$27.2 134.75,23 134.5,22.75 133.96,22.75 131.87,24.85 131.87,31.12 132.37,31.63 132.37,40.34 127.69,45.02 123.25,45.02
  Bottom 0.203: U$18.26 108.39,41.25 108.75,41.25 109,41 109,40.25 108.75,40 107.25,40 106.69,40.56 U$18.24 105.69,40.56 v105.5,40.75 | v106.5,42.75 106.45,42.8 U$18.17 | U$18.3 96.69,40.56 v96.5,40.75 | v97.5,42.75 97.45,42.8 v97.45,45.5 U$18.10 | U$18.3 | v105.5,40.75 105.25,40.5 | U$18.3 98,40.01 98,40 100.75,40 | v105.5,40.75 104.75,40 100.75,40 | v100.75,52.25 100.75,40
SCL19  (via drill 0.35)
  Top 0.203: v105.5,58.75 105.5,59.75 v106.5,60.75 | v96.5,58.75 96.5,59.75 v97.5,60.75 | U$19.31 100.75,71.68 v100.75,70.25 | v100.75,63.5 101.23,63.02 126.38,63.02 129.52,59.88 129.52,46.42 134.66,41.29 134.66,34.46 136.25,32.87 U$27.32
  Bottom 0.203: U$19.26 108.39,59.25 108.75,59.25 109,59 109,58.25 108.75,58 107.25,58 106.69,58.56 U$19.24 105.69,58.56 v105.5,58.75 | v106.5,60.75 106.45,60.8 U$19.17 | U$19.3 96.69,58.56 v96.5,58.75 | v97.5,60.75 97.45,60.8 U$19.10 | U$19.3 | v105.5,58.75 105.25,58.5 | U$19.3 98,58.01 98,58 100.75,58 | v105.5,58.75 104.75,58 100.75,58 | v100.75,70.25 v100.75,63.5 100.75,58
SCL20  (via drill 0.35)
  Top 0.203: v105.5,76.75 105.5,77.75 v106.5,78.75 | v96.5,76.75 96.5,77.75 v97.5,78.75 | U$20.31 100.75,89.68 v100.75,88.25 | v100.75,81.5 101.23,81.02 125.25,81.02 | 125.25,81.02 125.38,81.02 | 125.25,81.02 126.38,81.02 131.81,75.59 131.81,47.38 136.94,42.25 136.94,35.47 139.25,33.16 U$27.26
  Bottom 0.203: U$20.26 108.39,77.25 108.75,77.25 109,77 109,76.25 108.75,76 107.25,76 106.69,76.56 U$20.24 105.69,76.56 v105.5,76.75 | v106.5,78.75 106.45,78.8 U$20.17 | U$20.3 96.69,76.56 v96.5,76.75 | v97.5,78.75 97.45,78.8 U$20.10 | U$20.3 | v105.5,76.75 105.25,76.5 | U$20.3 98,76.01 98,76 100.75,76 | v105.5,76.75 104.75,76 100.75,76 | v100.75,88.25 v100.75,81.5 100.75,76
SCL21  (via drill 0.35)
  Top 0.203: v114.5,22.75 114.5,23.75 v115.25,24.75 | U$21.31 118.75,35.68 v118.75,34.25 | v118.75,29.5 119.09,29.16 128.09,29.16 129.96,27.29 129.96,24.06 133.17,20.84 135.29,20.84 137.25,22.81 U$27.7 | v125.5,25 125.5,24.75 v123.5,22.75
  Bottom 0.203: U$21.26 126.39,23.25 126.75,23.25 127,23 127,22.25 126.75,22 125.25,22 124.69,22.56 U$21.24 123.69,22.56 v123.5,22.75 | U$21.3 114.69,22.56 v114.5,22.75 | U$21.3 | v123.5,22.75 123.25,22.5 | U$21.3 116,22.01 116,22 120.5,22 | v123.5,22.75 122.75,22 120.5,22 | v118.75,34.25 v118.75,29.5 118.75,28.5 120.5,26.75 120.5,26.45 120.5,25.55 120.5,22 | U$21.10 115.25,31.36 v115.25,24.75 | v125.5,25 125.5,26.5 124.45,27.55 U$21.17
SCL22  (via drill 0.35)
  Top 0.203: v123.5,40.75 123.5,41.75 v124.5,42.75 | v114.5,40.75 114.5,41.75 v115.5,42.75 | U$22.31 118.75,53.68 v118.75,52.25 | v118.75,45.75 119.09,45.41 127.84,45.41 132.75,40.5 132.75,31.47 132.25,30.96 132.25,25 134,23.25 134.25,23.25 U$27.1
  Bottom 0.203: U$22.26 126.39,41.25 126.75,41.25 127,41 127,40.25 126.75,40 125.25,40 124.69,40.56 U$22.24 123.69,40.56 v123.5,40.75 | v124.5,42.75 124.45,42.8 U$22.17 | U$22.3 114.69,40.56 v114.5,40.75 | v115.5,42.75 115.45,42.8 U$22.10 | U$22.3 | v123.5,40.75 123.25,40.5 | U$22.3 116,40.01 116,40 118.75,40 | v123.5,40.75 122.75,40 118.75,40 | v118.75,52.25 v118.75,45.75 118.75,40
SCL23  (via drill 0.35)
  Top 0.203: v123.5,58.75 123.5,59.75 v124.5,60.75 | v114.5,58.75 114.5,59.75 v115.5,60.75 | U$23.31 118.75,71.68 v118.75,70.25 | v118.75,63.75 119.09,63.41 126.54,63.41 129.91,60.04 129.91,46.58 135.04,41.45 135.04,34.62 136.75,32.91 U$27.31
  Bottom 0.203: U$23.26 126.39,59.25 126.75,59.25 127,59 127,58.25 126.75,58 125.25,58 124.69,58.56 U$23.24 123.69,58.56 v123.5,58.75 | v124.5,60.75 124.45,60.8 U$23.17 | U$23.3 114.69,58.56 v114.5,58.75 | v115.5,60.75 115.45,60.8 U$23.10 | U$23.3 | v123.5,58.75 123.25,58.5 | U$23.3 116,58.01 116,58 118.75,58 | v123.5,58.75 122.75,58 118.75,58 | v118.75,70.25 v118.75,63.75 118.75,58
SCL24  (via drill 0.35)
  Top 0.203: v123.5,76.75 123.5,77.75 v124.5,78.75 | v114.5,76.75 114.5,77.75 v115.5,78.75 | U$24.31 118.75,89.68 v118.75,88.25 | v118.75,81.75 119.09,81.41 126.54,81.41 132.19,75.75 132.19,47.54 137.32,42.41 137.32,35.63 139.75,33.2 U$27.25
  Bottom 0.203: U$24.26 126.39,77.25 126.75,77.25 127,77 127,76.25 126.75,76 125.25,76 124.69,76.56 U$24.24 123.69,76.56 v123.5,76.75 | v124.5,78.75 124.45,78.8 U$24.17 | U$24.3 114.69,76.56 v114.5,76.75 | v115.5,78.75 115.45,78.8 U$24.10 | U$24.3 | v123.5,76.75 123.25,76.5 | U$24.3 116,76.01 116,76 118.75,76 | v123.5,76.75 122.75,76 118.75,76 | v118.75,88.25 v118.75,81.75 118.75,76
SCLK  (via drill 0.35)
  Top 0.203: JP4.11 60.43,25.93 v58.75,24.25 | v74.5,15.5 75.44,16.45 U$28.16 85.81,16.45 85.84,16.48 88.73,16.48 89.21,16 U$29.SCL | U$27.43 133.07,27.75 133.35,27.46 133.35,24.9 133.75,24.5 139.57,24.5 139.71,24.36 140.13,24.36 140.13,22.36 127.05,9.29 93.64,9.29 91.51,7.15 90.04,7.15 JP1.11 88.5,5.75 R1.1
  Bottom 0.203: 58.91,22.91 60.58,21.24 69.93,21.24 75.09,16.09 | 58.91,22.91 58.87,22.95 | 75.09,16.09 84.46,6.71 84.46,5.29 85.5,4.25 87.14,4.25 JP1.11 | v74.5,15.5 75.09,16.09 | 58.91,22.91 58.75,23.07 v58.75,24.25
SDA1  (via drill 0.35)
  Top 0.203: 30.88,35.71 U$1.33 31,35.61 30.88,35.49 v30.88,34.25 | U$26.7 137.25,45.5 v137.5,45.25
  Bottom 0.152: U$1.15 34.61,32.86
  Bottom 0.203: U$1.19 36.39,32.25 36.86,32.25 37.11,32 37.5,32 38,32.5 38,33 37.5,33.5 37,33.5 36.75,33.25 35,33.25 34.61,32.86 | 34.36,32.86 U$1.15 | U$1.1 24.75,24.56 24.75,32.25 25.36,32.86 | 25.36,32.86 U$1.8 25.61,32.86 | 34.36,33.5 34.36,33.89 32.88,35.38 | 34.36,33.5 34.36,32.86 | 25.36,32.86 28,35.5 32.75,35.5 32.88,35.38 | v30.88,34.25 31.62,33.5 34.36,33.5 | v137.5,45.25 137.5,42.69 135.78,40.97 135.72,40.97 132.16,37.41 34.91,37.41 32.88,35.38 | 34.14,23.86 U$1.22 34.14,23.86 | 34.36,32.86 33.12,31.62 33.12,24.88 33.62,24.38 33.62,24.36 34.12,23.86 34.14,23.86
SDA2  (via drill 0.35)
  Top 0.203: 30.88,53.71 U$2.33 31,53.61 30.88,53.49 v30.88,52.25 | U$26.6 136.75,45.5 v136.5,45.25
  Bottom 0.152: U$2.15 34.61,50.86
  Bottom 0.203: U$2.19 36.39,50.25 36.86,50.25 37.11,50 37.5,50 38,50.5 38,51 | 38,51 37.5,51.5 37,51.5 36.75,51.25 35,51.25 34.61,50.86 | U$2.22 33.75,42.56 33.75,50.25 34.36,50.86 | 34.36,50.86 U$2.15 | U$2.1 24.75,42.56 24.75,50.25 25.36,50.86 | 25.36,50.86 U$2.8 25.61,50.86 | 34.36,51.5 34.36,51.89 32.75,53.5 28,53.5 25.36,50.86 | 34.36,51.5 34.36,50.86 | v30.88,52.25 31.62,51.5 34.36,51.5 | 135.34,41.13 | 135.34,41.13 132,37.79 44.57,37.79 41.87,40.49 41.87,47.13 38,51 | v136.5,45.25 136.5,42.29 135.34,41.13
SDA3  (via drill 0.35)
  Top 0.203: 30.88,71.71 U$3.33 31,71.61 30.88,71.49 v30.88,70.25 | v136.5,59 136.75,58.75 U$26.31
  Bottom 0.152: U$3.15 34.61,68.86
  Bottom 0.203: U$3.19 36.39,68.25 36.86,68.25 37.11,68 37.5,68 38,68.5 38,69 37.5,69.5 37,69.5 36.75,69.25 35,69.25 34.61,68.86 | U$3.22 33.75,60.56 33.75,68.25 34.36,68.86 | 34.36,68.86 U$3.15 | U$3.1 24.75,60.56 24.75,68.25 25.36,68.86 | 25.36,68.86 U$3.8 25.61,68.86 | 34.36,69.5 34.36,69.89 32.75,71.5 | 34.36,69.5 34.36,68.86 | 32.75,71.5 28,71.5 25.36,68.86 | v30.88,70.25 31.62,69.5 34.36,69.5 | v136.5,59 136.5,61.25 | 136.5,61.25 136.5,61.56 | 136.5,61.25 136.5,63.19 134.85,64.85 126.17,73.52 120,73.52 | 120,73.52 119.75,73.52 119.5,73.52 | 120,73.52 34.77,73.52 32.75,71.5
SDA4  (via drill 0.35)
  Top 0.203: 30.88,89.71 U$4.33 31,89.61 30.88,89.49 v30.88,88.25 | v137.5,59 137.25,58.75 U$26.30
  Bottom 0.152: U$4.15 34.61,86.86
  Bottom 0.203: U$4.19 36.39,86.25 36.86,86.25 37.11,86 37.5,86 38,86.5 38,87 37.5,87.5 | 37.5,87.5 37,87.5 36.75,87.25 35,87.25 34.61,86.86 | U$4.22 33.75,78.56 33.75,86.25 34.36,86.86 | 34.36,86.86 U$4.15 | U$4.1 24.75,78.56 24.75,86.25 25.36,86.86 | 25.36,86.86 U$4.8 25.61,86.86 | 34.36,87.5 34.36,87.89 32.75,89.5 28,89.5 25.36,86.86 | 34.36,87.5 34.36,86.86 | v30.88,88.25 31.62,87.5 34.36,87.5 | v137.5,59 137.5,61.96 137.5,62.25 137.5,62.73 135.99,64.24 126.33,73.91 124.5,73.91 123,73.91 | 123,73.91 121.25,73.91 | 37.5,87.5 41.87,83.13 41.87,76.49 44.45,73.91 123,73.91
SDA5  (via drill 0.35)
  Top 0.203: 48.88,35.71 U$5.33 49,35.61 48.88,35.49 v48.88,34.25 | U$26.8 137.75,46.5 v138,46.25
  Bottom 0.152: U$5.15 52.61,32.86
  Bottom 0.203: U$5.19 54.39,32.25 54.86,32.25 55.11,32 55.5,32 56,32.5 56,33 55.5,33.5 55,33.5 54.75,33.25 53,33.25 52.61,32.86 | 52.36,32.86 51.75,32.25 51.75,28.5 51.5,28.25 51.5,24.75 52.39,23.86 U$5.22 | 52.36,32.86 U$5.15 | 43.36,32.86 U$5.8 43.61,32.86 | 52.36,33.5 52.36,33.89 50.75,35.5 | 52.36,33.5 52.36,32.86 | 50.75,35.5 46,35.5 43.36,32.86 | v48.88,34.25 49.62,33.5 52.36,33.5 | U$5.1 42.64,23.86 41.25,25.25 41.25,30.75 43.36,32.86 | v138,46.25 138,46 138.5,45.5 138.5,43.16 132.37,37.02 52.27,37.02 50.75,35.5
SDA6  (via drill 0.35)
  Top 0.203: 48.88,53.71 U$6.33 49,53.61 48.88,53.49 v48.88,52.25 | U$26.5 136.25,46 v135.5,45.25
  Bottom 0.152: U$6.15 52.61,50.86
  Bottom 0.203: U$6.19 54.39,50.25 54.86,50.25 55.11,50 55.5,50 56,50.5 56,51 | U$6.1 42.75,42.56 42.75,50.25 43.36,50.86 | 56,51 55.5,51.5 55,51.5 54.75,51.25 53,51.25 52.61,50.86 | 43.61,50.86 U$6.8 43.36,50.86 | 43.36,50.86 46,53.5 50.75,53.5 52.36,51.89 52.36,51.5 | v48.88,52.25 49.62,51.5 52.36,51.5 | 52.36,50.86 U$6.15 | 52.36,51.5 52.36,50.86 | 52.36,50.86 51.75,50.25 51.75,42.56 U$6.22 | v135.5,45.25 135.5,41.83 134.96,41.29 | 134.96,41.29 | 134.96,41.29 131.84,38.17 62.19,38.17 59.87,40.49 59.87,47.13 56,51
SDA7  (via drill 0.35)
  Top 0.203: 48.88,71.71 U$7.33 49,71.61 48.88,71.49 v48.88,70.25 | v136,58 136.25,57.75 U$26.32
  Bottom 0.152: U$7.15 52.61,68.86
  Bottom 0.203: U$7.19 54.39,68.25 54.86,68.25 55.11,68 55.5,68 56,68.5 56,69 55.5,69.5 55,69.5 54.75,69.25 53,69.25 52.61,68.86 | U$7.22 51.75,60.56 51.75,68.25 52.36,68.86 | 52.36,68.86 U$7.15 | U$7.1 42.75,60.56 42.75,68.25 43.36,68.86 | 43.36,68.86 U$7.8 43.61,68.86 | 52.36,69.5 52.36,69.89 50.75,71.5 | 52.36,69.5 52.36,68.86 | 50.75,71.5 46,71.5 43.36,68.86 | v48.88,70.25 49.62,69.5 52.36,69.5 | v136,58 136,58.25 135.5,58.75 135.5,63.66 126.01,73.14 52.39,73.14 50.75,71.5
SDA8  (via drill 0.35)
  Top 0.203: 48.88,89.71 U$8.33 49,89.61 48.88,89.49 v48.88,88.25 | v138.5,59 137.75,58.25 U$26.29
  Bottom 0.152: U$8.15 52.61,86.86
  Bottom 0.203: U$8.19 54.39,86.25 54.86,86.25 55.11,86 55.5,86 56,86.5 56,87 55.5,87.5 | 55.5,87.5 55,87.5 54.75,87.25 53,87.25 52.61,86.86 | U$8.22 51.75,78.56 51.75,86.25 52.36,86.86 | 52.36,86.86 U$8.15 | U$8.1 42.75,78.56 42.75,86.25 43.36,86.86 | 43.36,86.86 U$8.8 43.61,86.86 | 52.36,87.5 52.36,87.89 50.75,89.5 46,89.5 43.36,86.86 | 52.36,87.5 52.36,86.86 | v48.88,88.25 49.62,87.5 52.36,87.5 | v138.5,59 138.5,62.27 126.49,74.29 62.07,74.29 59.87,76.49 59.87,83.13 55.5,87.5
SDA9  (via drill 0.35)
  Top 0.203: 66.88,35.71 U$9.33 67,35.61 66.88,35.49 v66.88,34.25 | U$26.9 138.25,47 v139,46.25
  Bottom 0.152: U$9.15 70.61,32.86
  Bottom 0.203: U$9.19 72.39,32.25 72.86,32.25 73.11,32 73.5,32 74,32.5 74,33 73.5,33.5 73,33.5 72.75,33.25 71,33.25 70.61,32.86 | U$9.22 69.75,24.56 69.75,32.25 70.36,32.86 | 70.36,32.86 U$9.15 | 61.36,32.86 U$9.8 61.61,32.86 | 70.36,33.5 70.36,33.89 68.75,35.5 | 70.36,33.5 70.36,32.86 | 68.75,35.5 64,35.5 61.36,32.86 | v66.88,34.25 67.62,33.5 70.36,33.5 | U$9.1 60.14,23.86 59.25,24.75 59.25,30.75 61.36,32.86 | v139,46.25 139,43.12 132.53,36.64 69.89,36.64 68.75,35.5
SDA10  (via drill 0.35)
  Top 0.203: 66.88,53.71 U$10.33 67,53.61 66.88,53.49 v66.88,52.25 | U$26.4 135.75,46.5 v135.5,46.25
  Bottom 0.152: U$10.15 70.61,50.86
  Bottom 0.203: U$10.19 72.39,50.25 72.86,50.25 73.11,50 73.5,50 74,50.5 74,51 | 74,51 73.5,51.5 73,51.5 72.75,51.25 71,51.25 70.61,50.86 | U$10.22 69.75,42.56 69.75,50.25 70.36,50.86 | 70.36,50.86 U$10.15 | U$10.1 60.75,42.56 60.75,50.25 61.36,50.86 | 61.36,50.86 U$10.8 61.61,50.86 | 70.36,51.5 70.36,51.89 68.75,53.5 64,53.5 61.36,50.86 | 70.36,51.5 70.36,50.86 | v66.88,52.25 67.62,51.5 70.36,51.5 | v135.5,46.25 135.5,46.14 134.58,45.22 134.58,41.45 131.68,38.55 79.81,38.55 77.87,40.49 77.87,47.13 74,51
SDA11  (via drill 0.35)
  Top 0.203: 66.88,71.71 U$11.33 67,71.61 66.88,71.49 v66.88,70.25 | v135,58 135.75,57.25 U$26.33
  Bottom 0.152: U$11.15 70.61,68.86
  Bottom 0.203: U$11.19 72.39,68.25 72.86,68.25 73.11,68 73.5,68 74,68.5 74,69 73.5,69.5 73,69.5 72.75,69.25 71,69.25 70.61,68.86 | U$11.22 69.75,60.56 69.75,68.25 70.36,68.86 | 70.36,68.86 U$11.15 | U$11.1 60.75,60.56 60.75,68.25 61.36,68.86 | 61.36,68.86 U$11.8 61.61,68.86 | 70.36,69.5 70.36,69.89 68.75,71.5 | 70.36,69.5 70.36,68.86 | 68.75,71.5 64,71.5 61.36,68.86 | v66.88,70.25 67.62,69.5 70.36,69.5 | v135,58 135,63.62 125.85,72.76 70.01,72.76 68.75,71.5
SDA12  (via drill 0.35)
  Top 0.203: 66.88,89.71 U$12.33 67,89.61 66.88,89.49 v66.88,88.25 | v138.5,58 138.25,57.75 U$26.28
  Bottom 0.152: U$12.15 70.61,86.86
  Bottom 0.203: U$12.19 72.39,86.25 72.86,86.25 73.11,86 73.5,86 74,86.5 74,87 | 74,87 73.5,87.5 73,87.5 72.75,87.25 71,87.25 70.61,86.86 | U$12.22 69.75,78.56 69.75,86.25 70.36,86.86 | 70.36,86.86 U$12.15 | U$12.1 60.75,78.56 60.75,86.25 61.36,86.86 | 61.36,86.86 U$12.8 61.61,86.86 | 70.36,87.5 70.36,87.89 68.75,89.5 64,89.5 61.36,86.86 | 70.36,87.5 70.36,86.86 | v66.88,88.25 67.62,87.5 70.36,87.5 | v138.5,58 138.5,58.11 139.42,59.03 139.42,61.89 126.64,74.67 79.69,74.67 77.87,76.49 77.87,83.13 74,87
SDA13  (via drill 0.35)
  Top 0.203: 84.88,35.71 U$13.33 85,35.61 84.88,35.49 v84.88,34.25 | U$26.10 138.75,47.46 139.96,46.25 v140,46.25
  Bottom 0.203: 88.36,32.86 87.75,32.25 87.75,29.5 84.94,26.69 84.94,25.55 86.62,23.86 U$13.22 | 88.36,32.86 U$13.15 88.69,32.86 89.21,33.38 91.51,33.38 91.88,33.01 91.88,32.49 91.51,32.12 90.44,32.12 U$13.19 | U$13.1 78.75,24.56 78.75,32.25 79.36,32.86 | 79.36,32.86 U$13.8 79.61,32.86 | 88.36,33.5 88.36,33.89 86.75,35.5 | 88.36,33.5 88.36,32.86 | 86.75,35.5 82,35.5 79.36,32.86 | v84.88,34.25 85.62,33.5 88.36,33.5 | 86.75,35.5 87.51,36.26 132.68,36.26 140,43.58 v140,46.25
SDA14  (via drill 0.35)
  Top 0.203: 84.88,53.71 U$14.33 85,53.61 84.88,53.49 v84.88,52.25 | U$26.3 135.25,47 v134.5,46.25
  Bottom 0.152: U$14.15 88.61,50.86
  Bottom 0.203: U$14.19 90.39,50.25 90.86,50.25 91.11,50 91.5,50 92,50.5 92,51 91.5,51.5 | 91.5,51.5 91,51.5 90.75,51.25 89,51.25 88.61,50.86 | U$14.22 87.75,42.56 87.75,50.25 88.36,50.86 | 88.36,50.86 U$14.15 | U$14.1 78.75,42.56 78.75,50.25 79.36,50.86 | 79.36,50.86 U$14.8 79.61,50.86 | 88.36,51.5 88.36,51.89 86.75,53.5 82,53.5 79.36,50.86 | 88.36,51.5 88.36,50.86 | v84.88,52.25 85.62,51.5 88.36,51.5 | v134.5,46.25 134.5,45.68 134.2,45.38 134.2,41.63 131.5,38.93 97.43,38.93 95.87,40.49 95.87,47.13 91.5,51.5
SDA15  (via drill 0.35)
  Top 0.203: 84.88,71.71 U$15.33 85,71.61 84.88,71.49 v84.88,70.25 | v134,58 134.04,58 135.25,56.79 U$26.34
  Bottom 0.152: U$15.15 88.61,68.86
  Bottom 0.203: U$15.19 90.39,68.25 90.86,68.25 91.11,68 91.5,68 92,68.5 92,69 91.5,69.5 91,69.5 90.75,69.25 89,69.25 88.61,68.86 | U$15.22 87.75,60.56 87.75,68.25 88.36,68.86 | 88.36,68.86 U$15.15 | U$15.1 78.75,60.56 78.75,68.25 79.36,68.86 | 79.36,68.86 U$15.8 79.61,68.86 | 88.36,69.5 88.36,69.89 86.75,71.5 | 88.36,69.5 88.36,68.86 | 86.75,71.5 82,71.5 79.36,68.86 | v84.88,70.25 85.62,69.5 88.36,69.5 | v134,58 134,60.25 | 134,60.25 134,60.67 | 134,60.25 134,64.08 125.7,72.38 87.63,72.38 86.75,71.5
SDA16  (via drill 0.35)
  Top 0.203: 84.88,89.71 U$16.33 85,89.61 84.88,89.49 v84.88,88.25 | v139.5,58 138.75,57.25 U$26.27
  Bottom 0.152: U$16.15 88.61,86.86
  Bottom 0.203: U$16.19 90.39,86.25 90.86,86.25 91.11,86 91.5,86 92,86.5 92,87 | 92,87 91.5,87.5 91,87.5 90.75,87.25 89,87.25 88.61,86.86 | U$16.22 87.75,78.56 87.75,86.25 88.36,86.86 | 88.36,86.86 U$16.15 | U$16.1 78.75,78.56 78.75,86.25 79.36,86.86 | 79.36,86.86 U$16.8 79.61,86.86 | 88.36,87.5 88.36,87.89 86.75,89.5 82,89.5 79.36,86.86 | 88.36,87.5 88.36,86.86 | v84.88,88.25 85.62,87.5 88.36,87.5 | v139.5,58 139.5,58.57 139.8,58.87 139.8,62.05 126.8,75.05 97.31,75.05 95.87,76.49 95.87,83.13 92,87
SDA17  (via drill 0.35)
  Top 0.203: 103,35.61 102.88,35.49 102.88,35 | 102.88,35 v102.88,34.25 | U$26.11 139.25,47.5 139.75,47 v140.75,47 | 102.88,35.71 U$17.33 102.89,35.02 102.88,35
  Bottom 0.152: 106.61,32.86 U$17.15
  Bottom 0.203: 106.36,32.86 105.75,32.25 105.75,29.75 105,29 105,25.31 U$17.22 | 106.36,33.5 106.36,33.89 104.75,35.5 | 106.36,33.5 106.36,32.86 | 104.75,35.5 100,35.5 97.41,32.91 | 97.41,32.91 97.36,32.86 95,30.5 95,25.25 96.39,23.86 U$17.1 | v102.88,34.25 103.62,33.5 106.36,33.5 | 141,47 v140.75,47 140.75,43.79 132.84,35.88 105.13,35.88 104.75,35.5 | U$17.19 108.39,32.25 108.86,32.25 109.11,32 109.5,32 110,32.5 110,33 109.5,33.5 109,33.5 108.75,33.25 107,33.25 106.61,32.86 | 97.61,32.86 U$17.8 97.41,32.91 | U$17.15 106.36,32.86
SDA18  (via drill 0.35)
  Top 0.203: 102.88,53.71 U$18.33 103,53.61 102.88,53.49 v102.88,52.25 | U$26.2 134.75,47.5 134.25,47 133.75,47 v133.25,47.5
  Bottom 0.152: U$18.15 106.61,50.86
  Bottom 0.203: U$18.19 108.39,50.25 108.86,50.25 109.11,50 109.5,50 110,50.5 110,51 109.88,51.12 | 109.88,51.12 109.5,51.5 109,51.5 108.75,51.25 107,51.25 106.61,50.86 | U$18.22 105.75,42.56 105.75,50.25 106.36,50.86 | 106.36,50.86 U$18.15 | U$18.1 96.75,42.56 96.75,50.25 97.36,50.86 | 97.36,50.86 U$18.8 97.61,50.86 | 106.36,51.5 106.36,51.89 104.75,53.5 100,53.5 97.36,50.86 | 106.36,51.5 106.36,50.86 | v102.88,52.25 103.62,51.5 106.36,51.5 | v133.25,47.5 133.25,41.22 131.34,39.31 115.05,39.31 113.87,40.49 113.87,47.13 109.88,51.12
SDA19  (via drill 0.35)
  Top 0.203: 102.88,71.71 U$19.33 103,71.61 102.88,71.49 v102.88,70.25 | v133.25,57.25 134.25,57.25 134.75,56.75 U$26.35
  Bottom 0.152: U$19.15 106.61,68.86
  Bottom 0.203: U$19.19 108.39,68.25 108.86,68.25 109.11,68 109.5,68 110,68.5 110,69 109.5,69.5 109,69.5 108.75,69.25 107,69.25 106.61,68.86 | U$19.22 105.75,60.56 105.75,68.25 106.36,68.86 | 106.36,68.86 U$19.15 | U$19.1 96.75,60.56 96.75,68.25 97.36,68.86 | 97.36,68.86 U$19.8 97.61,68.86 | 106.36,69.5 106.36,69.89 104.75,71.5 | 106.36,69.5 106.36,68.86 | 104.75,71.5 100,71.5 97.36,68.86 | v102.88,70.25 103.62,69.5 106.36,69.5 | 133,57.25 v133.25,57.25 133.25,64.29 127.66,69.88 127.62,69.88 125.5,72 105.25,72 104.75,71.5
SDA20  (via drill 0.35)
  Top 0.203: 102.88,89.71 U$20.33 103,89.61 102.88,89.49 v102.88,88.25 | v140.5,58 139.25,56.75 U$26.26
  Bottom 0.152: U$20.15 106.61,86.86
  Bottom 0.203: U$20.19 108.39,86.25 108.86,86.25 109.11,86 109.5,86 110,86.5 110,87 | 110,87 109.5,87.5 109,87.5 108.75,87.25 107,87.25 106.61,86.86 | U$20.22 105.75,78.56 105.75,86.25 106.36,86.86 | 106.36,86.86 U$20.15 | U$20.1 96.75,78.56 96.75,86.25 97.36,86.86 | 97.36,86.86 U$20.8 97.61,86.86 | 106.36,87.5 106.36,87.89 104.75,89.5 100,89.5 97.36,86.86 | 106.36,87.5 106.36,86.86 | v102.88,88.25 103.62,87.5 106.36,87.5 | 110,87 113.87,83.13 113.87,76.49 114.93,75.43 126.96,75.43 140.5,61.89 v140.5,58
SDA21  (via drill 0.35)
  Top 0.203: 120.88,35.71 U$21.33 121,35.61 120.88,35.49 v120.88,34.25 | U$26.12 140.55,47.8 v140.75,48
  Bottom 0.152: U$21.15 124.61,32.86
  Bottom 0.203: U$21.19 126.39,32.25 126.86,32.25 127.11,32 127.5,32 128,32.5 128,33 127.5,33.5 127,33.5 126.75,33.25 125,33.25 124.61,32.86 | 124.36,32.86 123.75,32.25 123.75,28 122.75,27 122.75,25.56 U$21.22 | 124.36,32.86 U$21.15 | 115.36,32.86 U$21.8 115.61,32.86 | 124.36,33.5 124.36,33.89 122.75,35.5 | 124.36,33.5 124.36,32.86 | 122.75,35.5 118,35.5 115.36,32.86 | v120.88,34.25 121.62,33.5 124.36,33.5 | 115.36,32.86 112.75,30.25 112.75,25 113.89,23.86 U$21.1 | 122.75,35.5 133,35.5 141.38,43.88 141.38,47.26 140.75,47.89 v140.75,48
SDA22  (via drill 0.35)
  Top 0.203: 120.88,53.71 U$22.33 121,53.61 120.88,53.49 v120.88,52.25 | U$26.1 134.25,48 v133.75,48.5
  Bottom 0.152: U$22.15 124.61,50.86
  Bottom 0.203: U$22.19 126.39,50.25 126.86,50.25 127.11,50 127.5,50 128,50.5 128,51 127.62,51.38 | 127.62,51.38 127.5,51.5 127,51.5 126.75,51.25 125,51.25 124.61,50.86 | U$22.22 123.75,42.56 123.75,50.25 124.36,50.86 | 124.36,50.86 U$22.15 | U$22.1 114.75,42.56 114.75,50.25 115.36,50.86 | 115.36,50.86 U$22.8 115.61,50.86 | 124.36,51.5 124.36,51.89 122.75,53.5 118,53.5 115.36,50.86 | 124.36,51.5 124.36,50.86 | v120.88,52.25 121.62,51.5 124.36,51.5 | v133.75,48.5 130.5,48.5 127.62,51.38
SDA23  (via drill 0.35)
  Top 0.203: 120.88,71.71 U$23.33 121,71.61 120.88,71.49 v120.88,70.25 | U$26.36 134.25,56.71 133.71,56.71 v133.25,56.25
  Bottom 0.152: U$23.15 124.61,68.86
  Bottom 0.203: U$23.19 126.39,68.25 126.86,68.25 127.11,68 127.5,68 128,68.5 128,69 127.5,69.5 | 127.5,69.5 127,69.5 126.75,69.25 125,69.25 124.61,68.86 | U$23.22 123.75,60.56 123.75,68.25 124.36,68.86 | 124.36,68.86 U$23.15 | U$23.1 114.75,60.56 114.75,68.25 115.36,68.86 | 115.36,68.86 U$23.8 115.61,68.86 | 124.36,69.5 124.36,69.89 122.75,71.5 118,71.5 115.36,68.86 | 124.36,69.5 124.36,68.86 | v120.88,70.25 121.62,69.5 124.36,69.5 | v133.25,56.25 133.25,56.36 132.62,56.99 132.62,64.38 127.5,69.5
SDA24  (via drill 0.35)
  Top 0.203: 120.88,89.71 U$24.33 121,89.61 120.88,89.49 v120.88,88.25 | U$26.25 139.75,56.25 v140.5,57
  Bottom 0.152: U$24.15 124.61,86.86
  Bottom 0.203: U$24.19 126.39,86.25 126.86,86.25 127.11,86 127.5,86 128,86.5 128,87 | 128,87 127.5,87.5 127,87.5 126.75,87.25 125,87.25 124.61,86.86 | U$24.22 123.75,78.56 123.75,86.25 124.36,86.86 | 124.36,86.86 U$24.15 | U$24.1 114.75,78.56 114.75,86.25 115.36,86.86 | 115.36,86.86 U$24.8 115.61,86.86 | 124.36,87.5 124.36,87.89 122.75,89.5 118,89.5 115.36,86.86 | 124.36,87.5 124.36,86.86 | v120.88,88.25 121.62,87.5 124.36,87.5 | 128,87 128.34,86.66 128.34,74.59 141.13,61.8 141.13,57.74 140.5,57.11 v140.5,57
SDAT  (via drill 0.35)
  Top 0.203: JP4.12 62,26 v59.5,23.5 | U$28.15 76.76,15.25 79.62,15.25 | 79.62,15.25 85.88,8.98 R2.1 86,5.68 | 79.62,15.25 80.37,16 U$29.SDA | U$26.43 133.25,51.75 134,51 134,49.14 140.5,49.14 141.38,48.26 141.38,46.74 137.7,43.06 137.7,35.79 140.13,33.36 140.13,31.81 139.97,31.65 134.65,31.65 134,31 134,25.54 134.34,25.2 139.41,25.2 139.86,24.74 140.51,24.74 140.51,22.21 127.21,8.9 93.8,8.9 91.66,6.77 90.66,6.77 90.02,6.13 90.02,5.27 88.88,4.13 87.55,4.13 86,5.68 | JP1.12 86,5.68
  Bottom 0.203: 75.24,16.47 | 84.84,6.87 | 84.84,6.87 JP1.12 | 75.24,16.47 70.09,21.62 60.74,21.62 59.5,22.86 v59.5,23.5 | 75.24,16.47 84.84,6.87
VDD  (via drill 0.3, 0.35)
  Top 0.203: U$27.14 U$27.13 141.12,25.17 v141.12,24.62 | U$1.32 U$1.34 U$1.29 34.5,36.25 34.5,35.25 33.5,34.25 | v37.25,31.25 v37.25,32.75 35.75,34.25 33.5,34.25 | 33.5,34.25 v33,34.25 | U$2.32 U$2.34 U$2.29 34.5,54.25 34.5,53.25 33.5,52.25 | v37.25,49.25 v37.25,50.75 35.75,52.25 33.5,52.25 | 33.5,52.25 v33,52.25 | U$3.32 U$3.34 U$3.29 34.5,72.25 34.5,71.25 33.5,70.25 | v37.25,67.25 v37.25,68.75 35.75,70.25 33.5,70.25 | 33.5,70.25 v33,70.25 | U$4.32 U$4.34 U$4.29 34.5,90.25 34.5,89.25 33.5,88.25 | v37.25,85.25 v37.25,86.75 35.75,88.25 33.5,88.25 | 33.5,88.25 v33,88.25 | v55.25,85.25 v55.25,86.75 53.75,88.25 51.5,88.25 | 51.5,88.25 52.5,89.25 52.5,90.25 U$8.29 U$8.34 U$8.32 46.75,91.76 46.75,92.75 | 51.5,88.25 v51,88.25 | v55.25,67.25 v55.25,68.75 53.75,70.25 51.5,70.25 | 51.5,70.25 52.5,71.25 52.5,72.25 U$7.29 U$7.34 U$7.32 46.79,74.75 | 51.5,70.25 v51,70.25 | v73.25,31.25 v73.25,32.75 71.75,34.25 69.5,34.25 | 69.5,34.25 70.5,35.25 70.5,36.25 U$9.29 U$9.34 U$9.32 64.79,39 | 69.5,34.25 v69,34.25 | v73.25,49.25 v73.25,50.75 71.75,52.25 69.5,52.25 | 69.5,52.25 70.5,53.25 70.5,54.25 U$10.29 U$10.34 U$10.32 64.79,57 | 69.5,52.25 v69,52.25 | v73.25,67.25 v73.25,68.75 71.75,70.25 69.5,70.25 | 69.5,70.25 70.5,71.25 70.5,72.25 U$11.29 U$11.34 U$11.32 64.75,73.76 64.75,74.75 | 69.5,70.25 v69,70.25 | v73.25,85.25 v73.25,86.75 71.75,88.25 69.5,88.25 | 69.5,88.25 70.5,89.25 70.5,90.25 U$12.29 U$12.34 U$12.32 64.75,91.76 64.75,92.75 | 69.5,88.25 v69,88.25 | v91.25,85.25 v91.25,86.75 89.75,88.25 87.5,88.25 | 87.5,88.25 88.5,89.25 88.5,90.25 U$16.29 U$16.34 U$16.32 82.75,91.76 82.75,92.75 | 87.5,88.25 v87,88.25